# EAGLE schematic LIC_V-00237-01 (EAGLE 7.2.0)
AUTHOR: M. Petrilak; VERSION: 00
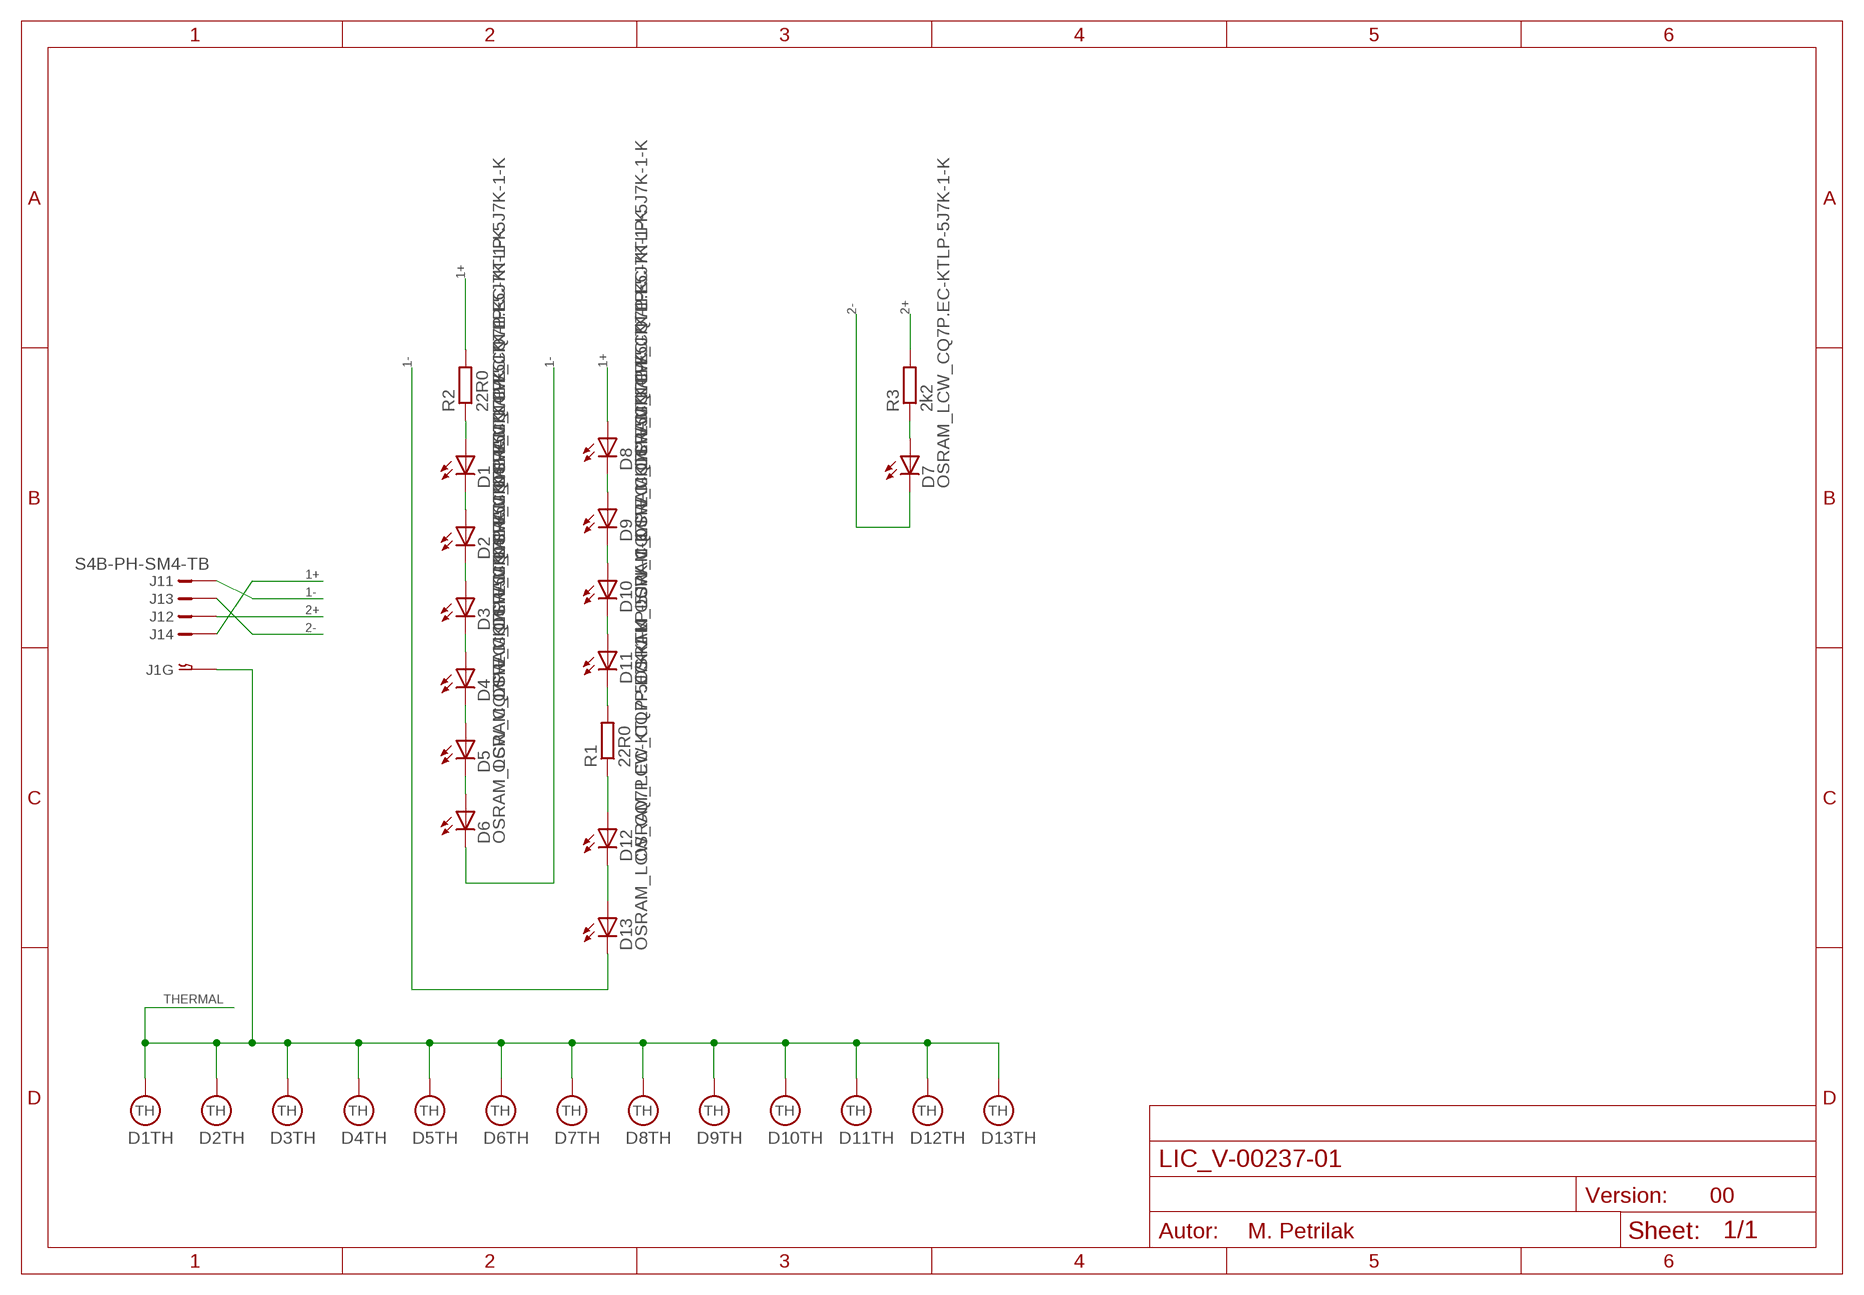
[diagram p0: schematic, sheet 1]

## Parts
D1  OSRAM_LCW_CQ7P.EC-KTLP-5J7K-1-K  [OSRAM_LCW]
D2  OSRAM_LCW_CQ7P.EC-KTLP-5J7K-1-K  [OSRAM_LCW]
D3  OSRAM_LCW_CQ7P.EC-KTLP-5J7K-1-K  [OSRAM_LCW]
D4  OSRAM_LCW_CQ7P.EC-KTLP-5J7K-1-K  [OSRAM_LCW]
D5  OSRAM_LCW_CQ7P.EC-KTLP-5J7K-1-K  [OSRAM_LCW]
D6  OSRAM_LCW_CQ7P.EC-KTLP-5J7K-1-K  [OSRAM_LCW]
D7  OSRAM_LCW_CQ7P.EC-KTLP-5J7K-1-K  [OSRAM_LCW]
D8  OSRAM_LCW_CQ7P.EC-KTLP-5J7K-1-K  [OSRAM_LCW]
D9  OSRAM_LCW_CQ7P.EC-KTLP-5J7K-1-K  [OSRAM_LCW]
D10  OSRAM_LCW_CQ7P.EC-KTLP-5J7K-1-K  [OSRAM_LCW]
D11  OSRAM_LCW_CQ7P.EC-KTLP-5J7K-1-K  [OSRAM_LCW]
D12  OSRAM_LCW_CQ7P.EC-KTLP-5J7K-1-K  [OSRAM_LCW]
D13  OSRAM_LCW_CQ7P.EC-KTLP-5J7K-1-K  [OSRAM_LCW]
J1  S4B-PH-SM4-TB  [S4B-PH-SM4-TB]
R1  22R0  R-EU_R1206  [R1206]
R2  22R0  R-EU_R1206  [R1206]
R3  2k2  R-EU_R1206  [R1206]

## Nets
1+: D8.A J1.4 R2.2
1-: D6.C D13.C J1.1
2+: J1.2 R3.2
2-: D7.C J1.3
N$1: D1.C D2.A
N$2: D2.C D3.A
N$3: D3.C D4.A
N$4: D4.C D5.A
N$5: D5.C D6.A
N$6: D1.A R2.1
N$7: D8.C D9.A
N$8: D9.C D10.A
N$9: D10.C D11.A
N$10: D12.A R1.1
N$11: D11.C R1.2
N$12: D7.A R3.1
N$14: D12.C D13.A
THERMAL: D1.THERMAL(TH) D2.THERMAL(TH) D3.THERMAL(TH) D4.THERMAL(TH) D5.THERMAL(TH) D6.THERMAL(TH) D7.THERMAL(TH) D8.THERMAL(TH) D9.THERMAL(TH) D10.THERMAL(TH) D11.THERMAL(TH) D12.THERMAL(TH) D13.THERMAL(TH) J1.GND1 J1.GND2

## Library data of the parts
D1-D13 = led:OSRAM_LCW_CQ7P.
J1 = con-jst:?4B-PH-SM4-TB: JST PH S4B-PH-SM4-TB pitch 2mm SMD side entry
R1-R3 = rcl:R-EU_: RESISTOR, European symbol